# Altium schematic sheet ADC_0.SchDoc
size 420 x 297 mm; SheetNumber: 2; SheetTotal: 13
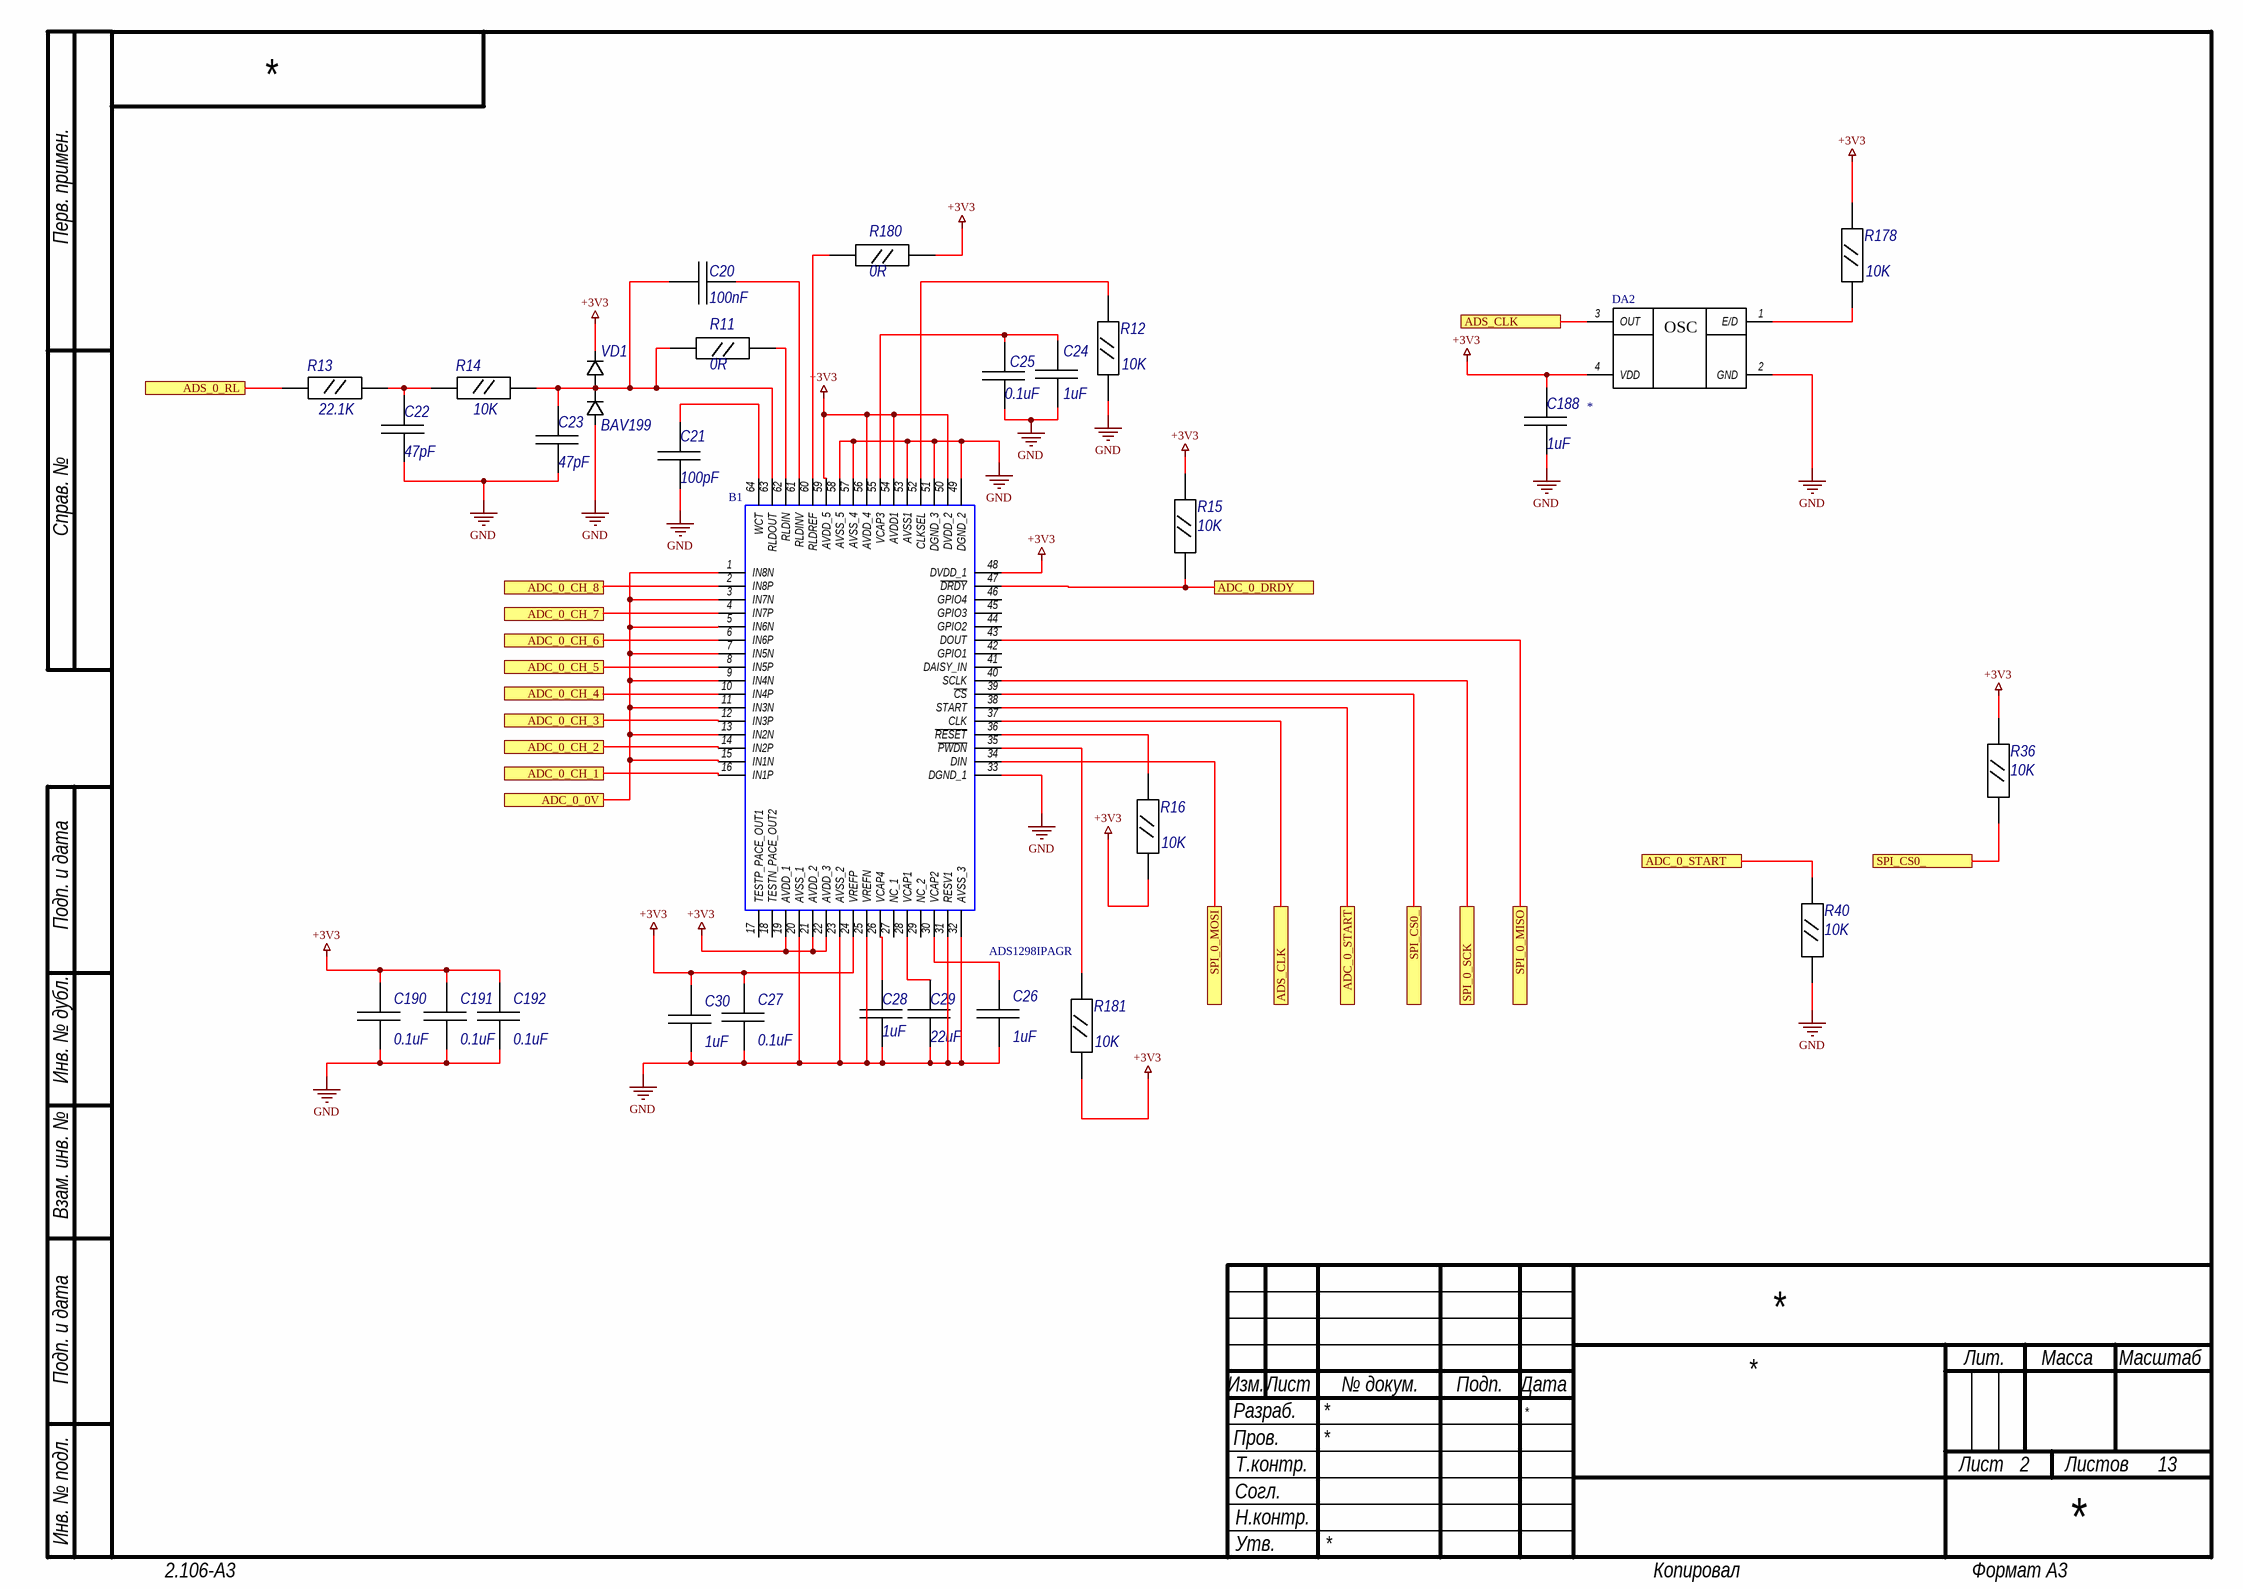
[diagram p0: ADC_0.SchDoc]

## Parts
B1  ADS1298IPAGR  [QFP50P1200X1200X120-64N]
C20  100nF  [C0603]
C21  100pF  [C0603]
C22  47pF  [C0603]
C23  47pF  [C0603]
C24  1uF  [C0603]
C25  0.1uF  [C0603]
C26  1uF  [C0603]
C27  0.1uF  [C0603]
C28  1uF  [C0603]
C29  22uF  [C0603]
C30  1uF  [C0603]
C188  1uF  [C0603]
C190  0.1uF  [C0603]
C191  0.1uF  [C0603]
C192  0.1uF  [C0603]
DA2  *  [Quartz 3.2х3.5х0.8]
R11  0R  [R0603]
R12  10K  [R0603]
R13  22.1K  [R0603]
R14  10K  [R0603]
R15  10K  [R0603]
R16  10K  [R0603]
R36  10K  [R0603]
R40  10K  [R0603]
R178  10K  [R0603]
R180  0R  [R0603]
R181  10K  [R0603]
VD1  BAV199  [SOT23]

## Ports
ADC_0_0V, ADC_0_CH_1, ADC_0_CH_2, ADC_0_CH_3, ADC_0_CH_4, ADC_0_CH_5, ADC_0_CH_6, ADC_0_CH_7, ADC_0_CH_8, ADC_0_DRDY, ADC_0_START, ADS_0_RL, ADS_CLK, SPI_0_MISO, SPI_0_MOSI, SPI_0_SCK, SPI_CS0_

## Nets
+3V3: B1.19(AVDD_1) B1.21(AVDD_2) B1.22(AVDD_3) B1.24(VREFP) B1.48(DVDD_1) B1.50(DVDD_2) B1.54(AVDD1) B1.56(AVDD_4) B1.59(AVDD_5) C27.2 C30.2 C188.2 C190.2 C191.2 C192.2 DA2.4(VDD) R15.2 R16.1 R36.2 R178.2 R180.1 R181.1 VD1.2
GND: B1.20(AVSS_1) B1.23(AVSS_2) B1.25(VREFN) B1.31(RESV1) B1.32(AVSS_3) B1.33(DGND_1) B1.49(DGND_2) B1.51(DGND_3) B1.53(AVSS1) B1.57(AVSS_4) B1.58(AVSS_5) C21.1 C22.1 C23.1 C24.1 C25.1 C26.1 C27.1 C28.1 C29.1 C30.1 C188.1 C190.1 C191.1 C192.1 DA2.2(GND) R12.1 R40.1 VD1.1
ADC_0_0V: B1.1(IN8N) B1.3(IN7N) B1.5(IN6N) B1.7(IN5N) B1.9(IN4N) B1.11(IN3N) B1.13(IN2N) B1.15(IN1N) ; port ADC_0_0V
ADC_0_CH_1: B1.16(IN1P) ; port ADC_0_CH_1
ADC_0_CH_2: B1.14(IN2P) ; port ADC_0_CH_2
ADC_0_CH_3: B1.12(IN3P) ; port ADC_0_CH_3
ADC_0_CH_4: B1.10(IN4P) ; port ADC_0_CH_4
ADC_0_CH_5: B1.8(IN5P) ; port ADC_0_CH_5
ADC_0_CH_6: B1.6(IN6P) ; port ADC_0_CH_6
ADC_0_CH_7: B1.4(IN7P) ; port ADC_0_CH_7
ADC_0_CH_8: B1.2(IN8P) ; port ADC_0_CH_8
ADC_0_DRDY: B1.47(~{DRDY}) R15.1 ; port ADC_0_DRDY
ADC_0_START: B1.38(START) R40.2 ; port ADC_0_START
ADS_0_RL: R13.1 ; port ADS_0_RL
ADS_CLK: B1.37(CLK) DA2.3(OUT) ; port ADS_CLK
SPI_0_MISO: B1.43(DOUT) ; port SPI_0_MISO
SPI_0_MOSI: B1.34(DIN) ; port SPI_0_MOSI
SPI_0_SCK: B1.40(SCLK) ; port SPI_0_SCK
SPI_CS0_: B1.39(~{CS}) R36.1 ; port SPI_CS0_
NetB1_26: B1.26(VCAP4) C28.2
NetB1_28: B1.28(VCAP1) C29.2
NetB1_30: B1.30(VCAP2) C26.2
NetB1_35: B1.35(~{PWDN}) R181.2
NetB1_36: B1.36(~{RESET}) R16.2
NetB1_52: B1.52(CLKSEL) R12.2
NetB1_55: B1.55(VCAP3) C24.2 C25.2
NetB1_60: B1.60(RLDREF) R180.2
NetB1_61: B1.61(RLDINV) C20.1
NetB1_62: B1.62(RLDIN) R11.1
NetB1_63: B1.63(RLDOUT) C20.2 C23.2 R11.2 R14.2 VD1.3
NetB1_64: B1.64(WCT) C21.2
NetC22_2: C22.2 R13.2 R14.1
NetDA2_1: DA2.1(E/D) R178.1

Not connected (* = marked no-connect by the designer): B1 17(TESTP_PACE_OUT1) 18(TESTN_PACE_OUT2) 27(NC_1) 29(NC_2) 41(DAISY_IN) 42(GPIO1) 44(GPIO2) 45(GPIO3) 46(GPIO4)

## Notes on the sheet
- Перв. примен.
- Справ. №
- Подп. и дата
- Инв. № дубл.
- Взам. инв. №
- Разраб.
- Изм.
- Лист
- № докум.
- Подп.
- Дата
- Лит.
- Масса
- Масштаб
- Пров.
- Т.контр.
- Листов
- Инв. № подл.
- Согл.
- Утв.
- Н.контр.
- 2.106-A3
- Копировал
- Формат А3
- (in symbol OSCILLATOR KX-7) OSC

## Library data of the parts
B1 = ADS1298IPAGR: 8-Channel 24-bit ADC With Integrated ECG Front End; Manufacturer_Name: Texas Instruments; Geometry.Height: 1.2mm; Mouser Part Number: 595-ADS1298IPAGR; Mouser Price/Stock: https://www.mouser.co.uk/ProductDetail/Texas-Instruments/ADS1298IPAGR?qs=Z6FgPJT5dDSzK7JhuKfPmw%3D%3D; Manufacturer_Part_Number: ADS1298IPAGR; Datasheet Link: http://www.ti.com/lit/ds/symlink/ads1294.pdf
C20-C30 C188 C190-C192 = CC_SMD_0603: Ceramic Capacitor SMD; Package: 0603
  C20: Value: 100nF
  C21: Value: 100pF
  C22 C23: Value: 47pF
  C24 C26 C28 C30 C188: Value: 1uF
  C25 C27 C190-C192: Value: 0.1uF
  C29: Value: 22uF
DA2 = OSCILLATOR KX-7: Oscillator; Value: *; Package: 4 Lead 3.2x3.5
R11-R16 R36 R40 R178 R180 R181 = R0603: Resistor SMD
  R11 R180: Value: 0R
  R12 R14-R16 R36 R40 R178 R181: Value: 10K
  R13: Value: 22.1K
VD1 = DIODE_BAV199: Diod Schottky; Diode Type: Standard; Package: SOT-23; PartNumber: BAV199; Manufacturer Part Number 1: BAV199